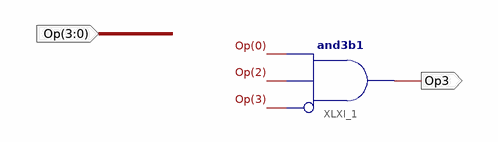
[diagram p0: schematic sheet 1]
// Xilinx ISE schematic Op3Module.sch (spartan3e) as structural Verilog: 1 symbols, 2 ports
module Op3Module (
  input  [3:0] Op,
  output Op3
);

  and XLXI_1 (Op3, ~Op[3], Op[2], Op[0]);  // and3b1
endmodule
